# EAGLE schematic 4_cpu_alu (EAGLE 6.6.0)

## Sheet 1 of 2
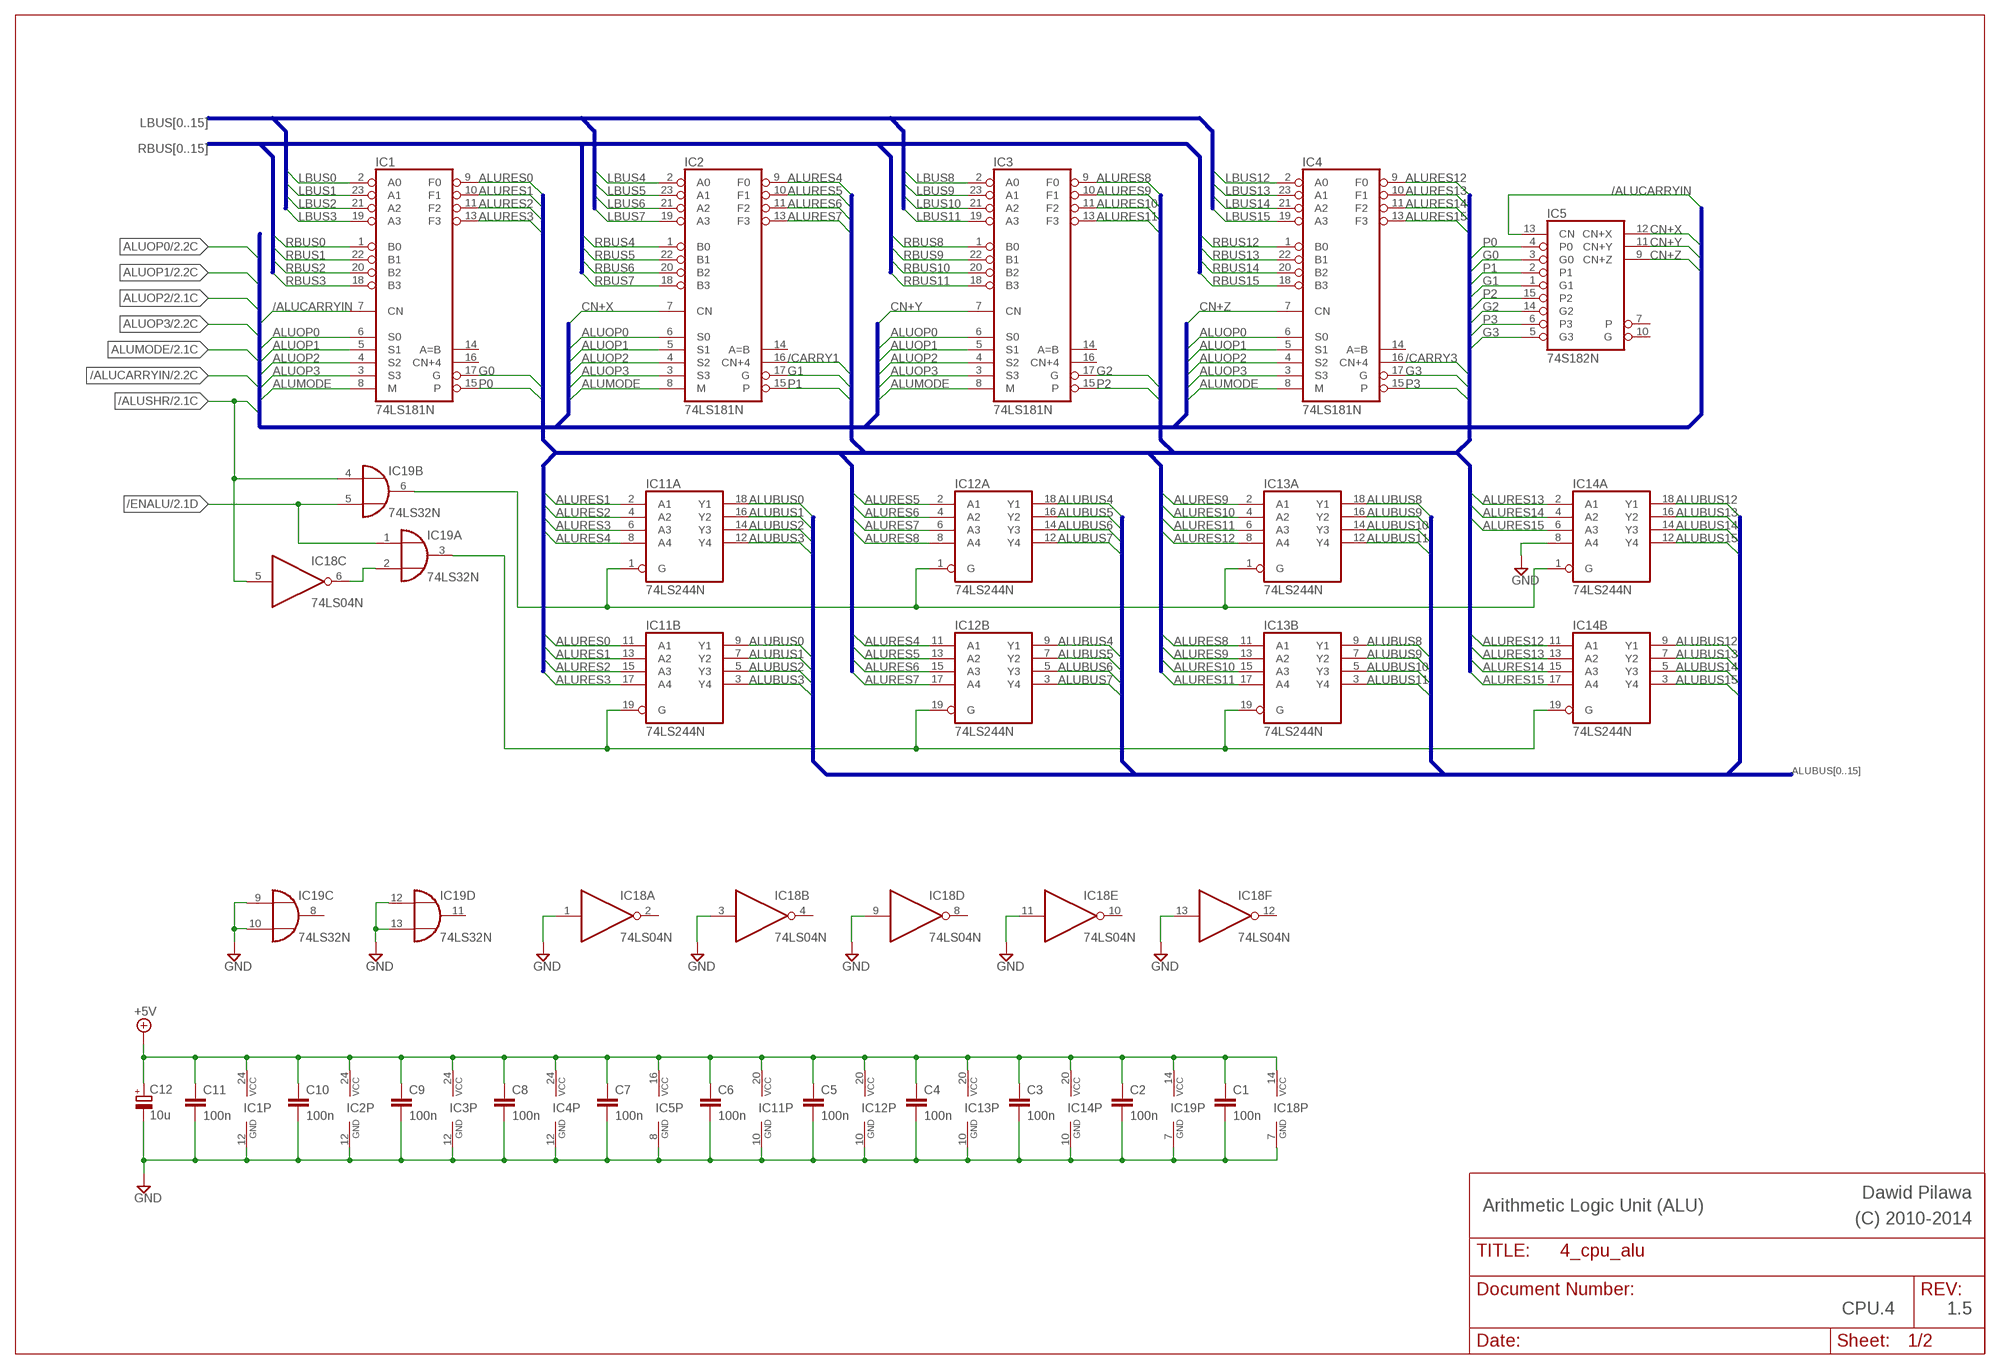
[diagram p0: schematic, sheet 1]

### Parts
C1  100n  C-EU050-024X044  [C050-024X044]
C2  100n  C-EU050-024X044  [C050-024X044]
C3  100n  C-EU050-024X044  [C050-024X044]
C4  100n  C-EU050-024X044  [C050-024X044]
C5  100n  C-EU050-024X044  [C050-024X044]
C6  100n  C-EU050-024X044  [C050-024X044]
C7  100n  C-EU050-024X044  [C050-024X044]
C8  100n  C-EU050-024X044  [C050-024X044]
C9  100n  C-EU050-024X044  [C050-024X044]
C10  100n  C-EU050-024X044  [C050-024X044]
C11  100n  C-EU050-024X044  [C050-024X044]
C12  10u  CPOL-EUE2.5-6  [E2,5-6]
IC1  74LS181N  [DIL24-6]
IC2  74LS181N  [DIL24-6]
IC3  74LS181N  [DIL24-6]
IC4  74LS181N  [DIL24-6]
IC5  74S182N  [DIL16]
IC11  74LS244N  [DIL20]
IC12  74LS244N  [DIL20]
IC13  74LS244N  [DIL20]
IC14  74LS244N  [DIL20]
IC18  74LS04N  [DIL14]
IC19  74LS32N  [DIL14]

### Nets
+5V: C1.1 C2.1 C3.1 C4.1 C5.1 C6.1 C7.1 C8.1 C9.1 C10.1 C11.1 C12.+ IC1.24(VCC) IC2.24(VCC) IC3.24(VCC) IC4.24(VCC) IC5.16(VCC) IC11.20(P:VCC) IC12.20(P:VCC) IC13.20(P:VCC) IC14.20(P:VCC) IC18.14(P:VCC) IC19.14(P:VCC) ; also sheet 2
/ALUCARRYIN: IC1.7(CN) IC5.13(CN) ; also sheet 2
/ALUSHR: IC18.5(C:I) IC19.4(B:I0) ; also sheet 2
/CARRY1: IC2.16(CN+4) ; also sheet 2
/CARRY3: IC4.16(CN+4) ; also sheet 2
/ENALU: IC19.1(A:I0) IC19.5(B:I1) ; also sheet 2
ALUBUS0: IC11.9(B:Y1) IC11.18(A:Y1) ; also sheet 2
ALUBUS1: IC11.7(B:Y2) IC11.16(A:Y2) ; also sheet 2
ALUBUS2: IC11.5(B:Y3) IC11.14(A:Y3) ; also sheet 2
ALUBUS3: IC11.3(B:Y4) IC11.12(A:Y4) ; also sheet 2
ALUBUS4: IC12.9(B:Y1) IC12.18(A:Y1) ; also sheet 2
ALUBUS5: IC12.7(B:Y2) IC12.16(A:Y2) ; also sheet 2
ALUBUS6: IC12.5(B:Y3) IC12.14(A:Y3) ; also sheet 2
ALUBUS7: IC12.3(B:Y4) IC12.12(A:Y4) ; also sheet 2
ALUBUS8: IC13.9(B:Y1) IC13.18(A:Y1) ; also sheet 2
ALUBUS9: IC13.7(B:Y2) IC13.16(A:Y2) ; also sheet 2
ALUBUS10: IC13.5(B:Y3) IC13.14(A:Y3) ; also sheet 2
ALUBUS11: IC13.3(B:Y4) IC13.12(A:Y4) ; also sheet 2
ALUBUS12: IC14.9(B:Y1) IC14.18(A:Y1) ; also sheet 2
ALUBUS13: IC14.7(B:Y2) IC14.16(A:Y2) ; also sheet 2
ALUBUS14: IC14.5(B:Y3) IC14.14(A:Y3) ; also sheet 2
ALUBUS15: IC14.3(B:Y4) IC14.12(A:Y4) ; also sheet 2
ALUMODE: IC1.8(M) IC2.8(M) IC3.8(M) IC4.8(M) ; also sheet 2
ALUOP0: IC1.6(S0) IC2.6(S0) IC3.6(S0) IC4.6(S0) ; also sheet 2
ALUOP1: IC1.5(S1) IC2.5(S1) IC3.5(S1) IC4.5(S1) ; also sheet 2
ALUOP2: IC1.4(S2) IC2.4(S2) IC3.4(S2) IC4.4(S2) ; also sheet 2
ALUOP3: IC1.3(S3) IC2.3(S3) IC3.3(S3) IC4.3(S3) ; also sheet 2
ALURES0: IC1.9(F0) IC11.11(B:A1) ; also sheet 2
ALURES1: IC1.10(F1) IC11.2(A:A1) IC11.13(B:A2)
ALURES2: IC1.11(F2) IC11.4(A:A2) IC11.15(B:A3)
ALURES3: IC1.13(F3) IC11.6(A:A3) IC11.17(B:A4)
ALURES4: IC2.9(F0) IC11.8(A:A4) IC12.11(B:A1)
ALURES5: IC2.10(F1) IC12.2(A:A1) IC12.13(B:A2)
ALURES6: IC2.11(F2) IC12.4(A:A2) IC12.15(B:A3)
ALURES7: IC2.13(F3) IC12.6(A:A3) IC12.17(B:A4)
ALURES8: IC3.9(F0) IC12.8(A:A4) IC13.11(B:A1) ; also sheet 2
ALURES9: IC3.10(F1) IC13.2(A:A1) IC13.13(B:A2)
ALURES10: IC3.11(F2) IC13.4(A:A2) IC13.15(B:A3)
ALURES11: IC3.13(F3) IC13.6(A:A3) IC13.17(B:A4)
ALURES12: IC4.9(F0) IC13.8(A:A4) IC14.11(B:A1)
ALURES13: IC4.10(F1) IC14.2(A:A1) IC14.13(B:A2)
ALURES14: IC4.11(F2) IC14.4(A:A2) IC14.15(B:A3)
ALURES15: IC4.13(F3) IC14.6(A:A3) IC14.17(B:A4)
CN+X: IC2.7(CN) IC5.12(CN+X)
CN+Y: IC3.7(CN) IC5.11(CN+Y)
CN+Z: IC4.7(CN) IC5.9(CN+Z)
G0: IC1.17(G) IC5.3(G0)
G1: IC2.17(G) IC5.1(G1)
G2: IC3.17(G) IC5.14(G2)
G3: IC4.17(G) IC5.5(G3)
GND: C1.2 C2.2 C3.2 C4.2 C5.2 C6.2 C7.2 C8.2 C9.2 C10.2 C11.2 C12.- IC1.12(GND) IC2.12(GND) IC3.12(GND) IC4.12(GND) IC5.8(GND) IC11.10(P:GND) IC12.10(P:GND) IC13.10(P:GND) IC14.8(A:A4) IC14.10(P:GND) IC18.1(A:I) IC18.3(B:I) IC18.7(P:GND) IC18.9(D:I) IC18.11(E:I) IC18.13(F:I) IC19.7(P:GND) IC19.9(C:I0) IC19.10(C:I1) IC19.12(D:I0) IC19.13(D:I1) ; also sheet 2
LBUS0: IC1.2(A0) ; also sheet 2
LBUS1: IC1.23(A1) ; also sheet 2
LBUS2: IC1.21(A2) ; also sheet 2
LBUS3: IC1.19(A3) ; also sheet 2
LBUS4: IC2.2(A0) ; also sheet 2
LBUS5: IC2.23(A1) ; also sheet 2
LBUS6: IC2.21(A2) ; also sheet 2
LBUS7: IC2.19(A3) ; also sheet 2
LBUS8: IC3.2(A0) ; also sheet 2
LBUS9: IC3.23(A1) ; also sheet 2
LBUS10: IC3.21(A2) ; also sheet 2
LBUS11: IC3.19(A3) ; also sheet 2
LBUS12: IC4.2(A0) ; also sheet 2
LBUS13: IC4.23(A1) ; also sheet 2
LBUS14: IC4.21(A2) ; also sheet 2
LBUS15: IC4.19(A3) ; also sheet 2
N$1: IC11.1(A:G) IC12.1(A:G) IC13.1(A:G) IC14.1(A:G) IC19.6(B:O)
N$4: IC18.6(C:O) IC19.2(A:I1)
N$5: IC11.19(B:G) IC12.19(B:G) IC13.19(B:G) IC14.19(B:G) IC19.3(A:O)
P0: IC1.15(P) IC5.4(P0)
P1: IC2.15(P) IC5.2(P1)
P2: IC3.15(P) IC5.15(P2)
P3: IC4.15(P) IC5.6(P3)
RBUS0: IC1.1(B0) ; also sheet 2
RBUS1: IC1.22(B1) ; also sheet 2
RBUS2: IC1.20(B2) ; also sheet 2
RBUS3: IC1.18(B3) ; also sheet 2
RBUS4: IC2.1(B0) ; also sheet 2
RBUS5: IC2.22(B1) ; also sheet 2
RBUS6: IC2.20(B2) ; also sheet 2
RBUS7: IC2.18(B3) ; also sheet 2
RBUS8: IC3.1(B0) ; also sheet 2
RBUS9: IC3.22(B1) ; also sheet 2
RBUS10: IC3.20(B2) ; also sheet 2
RBUS11: IC3.18(B3) ; also sheet 2
RBUS12: IC4.1(B0) ; also sheet 2
RBUS13: IC4.22(B1) ; also sheet 2
RBUS14: IC4.20(B2) ; also sheet 2
RBUS15: IC4.18(B3) ; also sheet 2
Unconnected: IC1.14(A=B) IC1.16(CN+4) IC2.14(A=B) IC3.14(A=B) IC3.16(CN+4) IC4.14(A=B) IC5.7(P) IC5.10(G) IC18.2(A:O) IC18.4(B:O) IC18.8(D:O) IC18.10(E:O) IC18.12(F:O) IC19.8(C:O) IC19.11(D:O)

### Buses
RBUS[0..15]
LBUS[0..15]
ALUOP[0..3],ALUMODE,/ALUSHR,/ALUCARRYIN,CN+X,CN+Y,CN+Z
ALURES[0..15],/CARRY[0..3],P[0..3],G[0..3]
ALUBUS[0..15]

### Notes on the sheet
- Dawid Pilawa
- Arithmetic Logic Unit (ALU) | (C) 2010-2014
- CPU.4 | 1.5

## Sheet 2 of 2
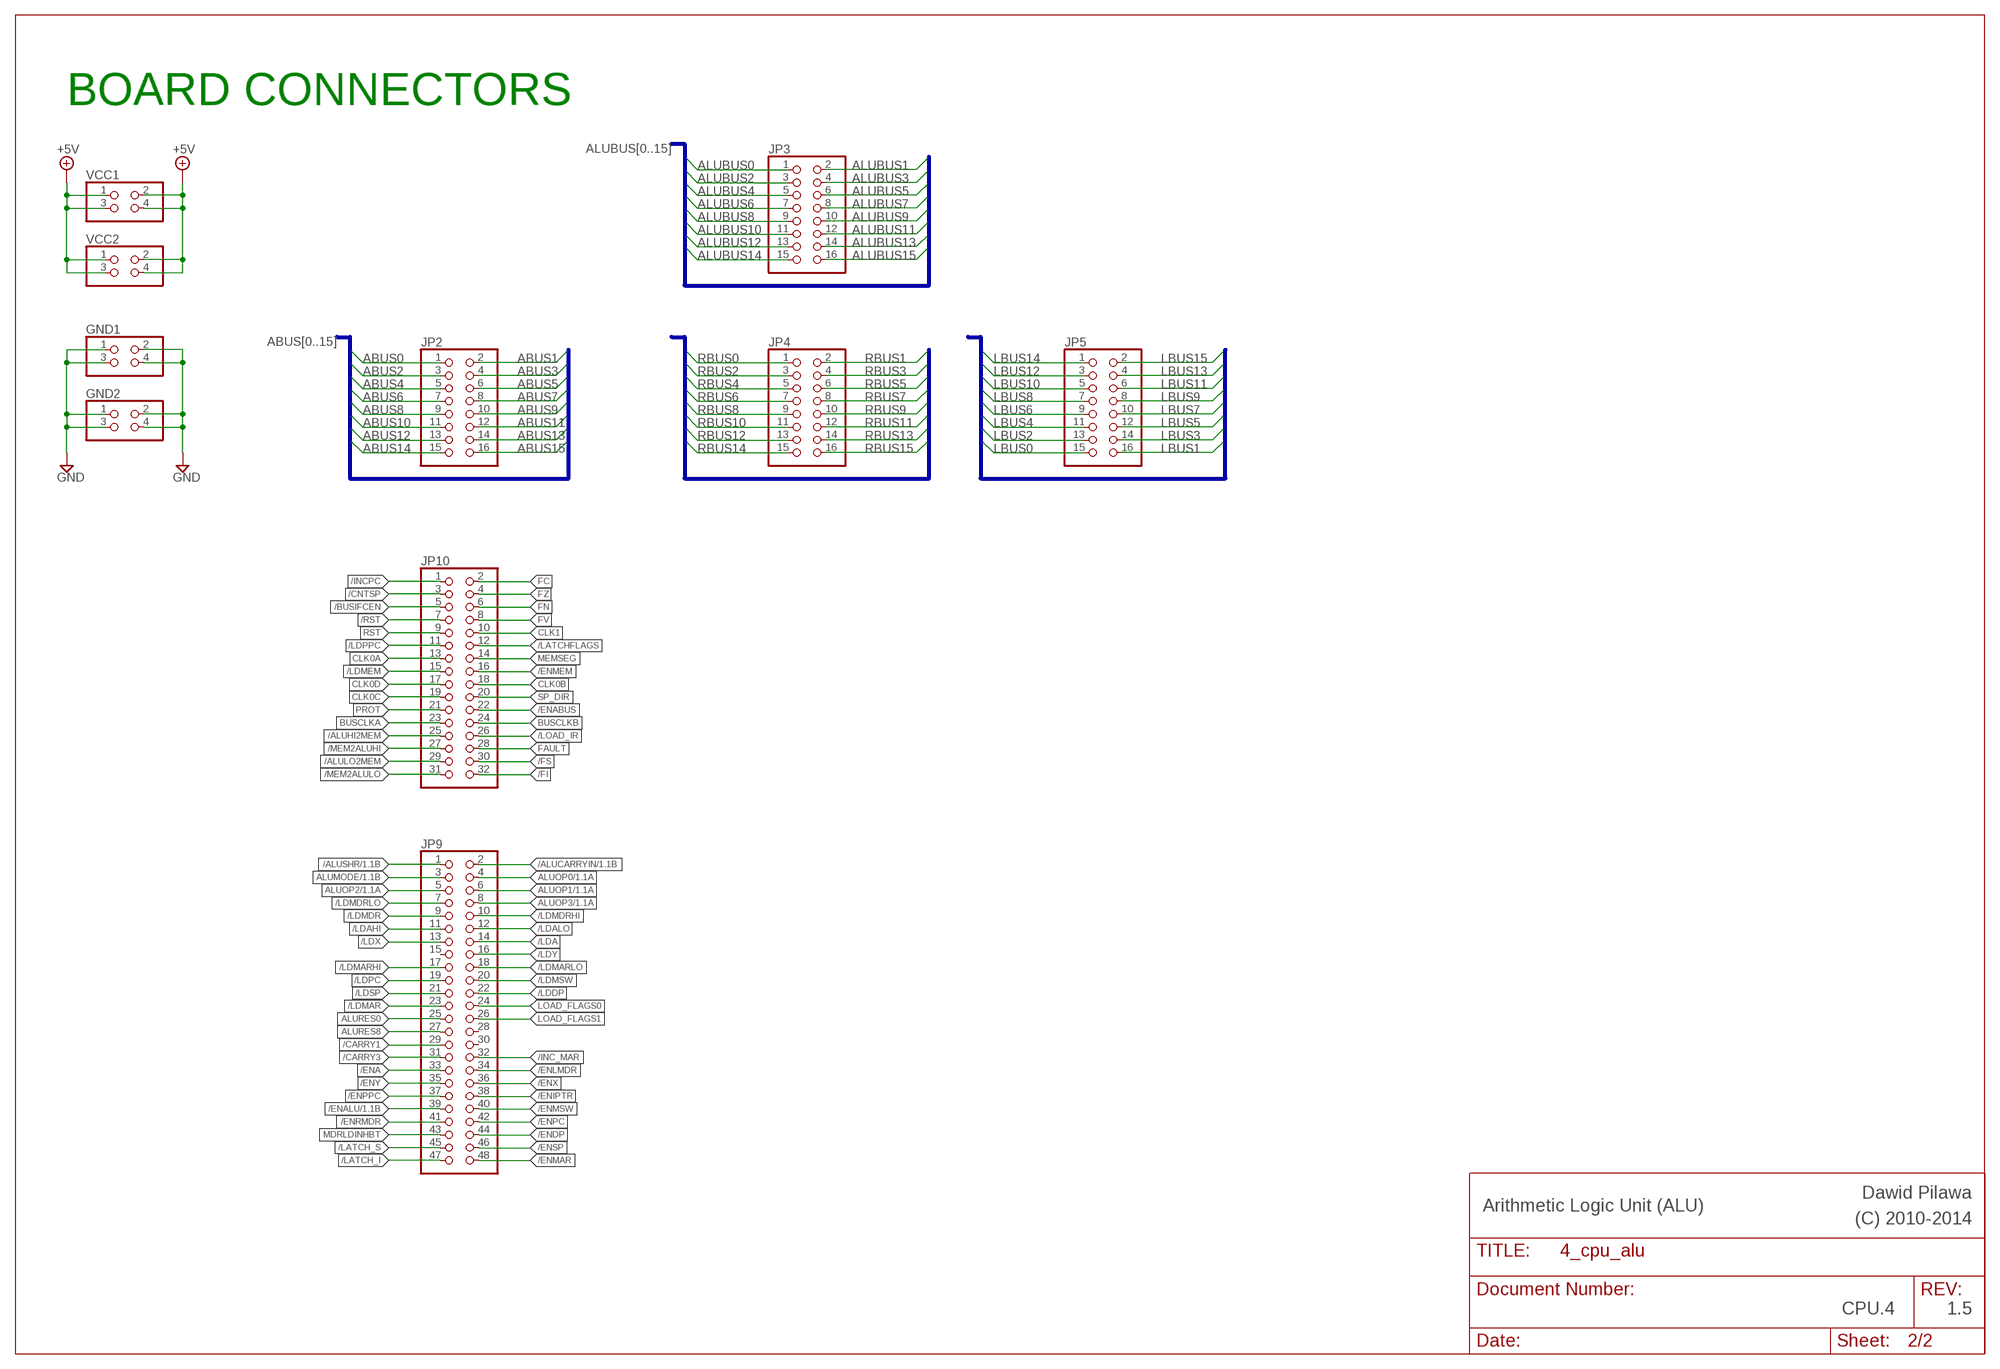
[diagram p1: schematic, sheet 2]

### Parts
GND1  PINHD-2X2  [2X02]
GND2  PINHD-2X2  [2X02]
JP2  PINHD-2X8  [2X08]
JP3  PINHD-2X8  [2X08]
JP4  PINHD-2X8  [2X08]
JP5  PINHD-2X8  [2X08]
JP9  PINHD-2X24  [2X24]
JP10  PINHD-2X16  [2X16]
VCC1  PINHD-2X2  [2X02]
VCC2  PINHD-2X2  [2X02]

### Nets
+5V: VCC1.1 VCC1.2 VCC1.3 VCC1.4 VCC2.1 VCC2.2 VCC2.3 VCC2.4 ; also sheet 1
/ALUCARRYIN: JP9.2 ; also sheet 1
/ALUHI2MEM: JP10.25
/ALULO2MEM: JP10.29
/ALUSHR: JP9.1 ; also sheet 1
/BUSIFCEN: JP10.5
/CARRY1: JP9.29 ; also sheet 1
/CARRY3: JP9.31 ; also sheet 1
/CNTSP: JP10.3
/ENA: JP9.33
/ENABUS: JP10.22
/ENALU: JP9.39 ; also sheet 1
/ENDP: JP9.44
/ENIPTR: JP9.38
/ENLMDR: JP9.34
/ENMAR: JP9.48
/ENMEM: JP10.16
/ENMSW: JP9.40
/ENPC: JP9.42
/ENPPC: JP9.37
/ENRMDR: JP9.41
/ENSP: JP9.46
/ENX: JP9.36
/ENY: JP9.35
/FI: JP10.32
/FS: JP10.30
/INC_MAR: JP9.32
/INCPC: JP10.1
/LATCH_I: JP9.47
/LATCH_S: JP9.45
/LATCHFLAGS: JP10.12
/LDA: JP9.14
/LDAHI: JP9.11
/LDALO: JP9.12
/LDDP: JP9.22
/LDMAR: JP9.23
/LDMARHI: JP9.17
/LDMARLO: JP9.18
/LDMDR: JP9.9
/LDMDRHI: JP9.10
/LDMDRLO: JP9.7
/LDMEM: JP10.15
/LDMSW: JP9.20
/LDPC: JP9.19
/LDPPC: JP10.11
/LDSP: JP9.21
/LDX: JP9.13
/LDY: JP9.16
/LOAD_IR: JP10.26
/MEM2ALUHI: JP10.27
/MEM2ALULO: JP10.31
/RST: JP10.7
ABUS0: JP2.1
ABUS1: JP2.2
ABUS2: JP2.3
ABUS3: JP2.4
ABUS4: JP2.5
ABUS5: JP2.6
ABUS6: JP2.7
ABUS7: JP2.8
ABUS8: JP2.9
ABUS9: JP2.10
ABUS10: JP2.11
ABUS11: JP2.12
ABUS12: JP2.13
ABUS13: JP2.14
ABUS14: JP2.15
ABUS15: JP2.16
ALUBUS0: JP3.1 ; also sheet 1
ALUBUS1: JP3.2 ; also sheet 1
ALUBUS2: JP3.3 ; also sheet 1
ALUBUS3: JP3.4 ; also sheet 1
ALUBUS4: JP3.5 ; also sheet 1
ALUBUS5: JP3.6 ; also sheet 1
ALUBUS6: JP3.7 ; also sheet 1
ALUBUS7: JP3.8 ; also sheet 1
ALUBUS8: JP3.9 ; also sheet 1
ALUBUS9: JP3.10 ; also sheet 1
ALUBUS10: JP3.11 ; also sheet 1
ALUBUS11: JP3.12 ; also sheet 1
ALUBUS12: JP3.13 ; also sheet 1
ALUBUS13: JP3.14 ; also sheet 1
ALUBUS14: JP3.15 ; also sheet 1
ALUBUS15: JP3.16 ; also sheet 1
ALUMODE: JP9.3 ; also sheet 1
ALUOP0: JP9.4 ; also sheet 1
ALUOP1: JP9.6 ; also sheet 1
ALUOP2: JP9.5 ; also sheet 1
ALUOP3: JP9.8 ; also sheet 1
ALURES0: JP9.25 ; also sheet 1
ALURES8: JP9.27 ; also sheet 1
BUSCLKA: JP10.23
BUSCLKB: JP10.24
CLK0A: JP10.13
CLK0B: JP10.18
CLK0C: JP10.19
CLK0D: JP10.17
CLK1: JP10.10
FAULT: JP10.28
FC: JP10.2
FN: JP10.6
FV: JP10.8
FZ: JP10.4
GND: GND1.1 GND1.2 GND1.3 GND1.4 GND2.1 GND2.2 GND2.3 GND2.4 ; also sheet 1
LBUS0: JP5.15 ; also sheet 1
LBUS1: JP5.16 ; also sheet 1
LBUS2: JP5.13 ; also sheet 1
LBUS3: JP5.14 ; also sheet 1
LBUS4: JP5.11 ; also sheet 1
LBUS5: JP5.12 ; also sheet 1
LBUS6: JP5.9 ; also sheet 1
LBUS7: JP5.10 ; also sheet 1
LBUS8: JP5.7 ; also sheet 1
LBUS9: JP5.8 ; also sheet 1
LBUS10: JP5.5 ; also sheet 1
LBUS11: JP5.6 ; also sheet 1
LBUS12: JP5.3 ; also sheet 1
LBUS13: JP5.4 ; also sheet 1
LBUS14: JP5.1 ; also sheet 1
LBUS15: JP5.2 ; also sheet 1
LOAD_FLAGS0: JP9.24
LOAD_FLAGS1: JP9.26
MDRLDINHBT: JP9.43
MEMSEG: JP10.14
PROT: JP10.21
RBUS0: JP4.1 ; also sheet 1
RBUS1: JP4.2 ; also sheet 1
RBUS2: JP4.3 ; also sheet 1
RBUS3: JP4.4 ; also sheet 1
RBUS4: JP4.5 ; also sheet 1
RBUS5: JP4.6 ; also sheet 1
RBUS6: JP4.7 ; also sheet 1
RBUS7: JP4.8 ; also sheet 1
RBUS8: JP4.9 ; also sheet 1
RBUS9: JP4.10 ; also sheet 1
RBUS10: JP4.11 ; also sheet 1
RBUS11: JP4.12 ; also sheet 1
RBUS12: JP4.13 ; also sheet 1
RBUS13: JP4.14 ; also sheet 1
RBUS14: JP4.15 ; also sheet 1
RBUS15: JP4.16 ; also sheet 1
RST: JP10.9
SP_DIR: JP10.20
Unconnected: JP9.15 JP9.28 JP9.30

### Buses
RBUS[0..15]
LBUS[0..15]
ALUBUS[0..15]
ABUS[0..15]

### Notes on the sheet
- BOARD CONNECTORS
- Dawid Pilawa
- Arithmetic Logic Unit (ALU) | (C) 2010-2014
- CPU.4 | 1.5

## Library data of the parts
C1-C11 = rcl:C-EU: CAPACITOR, European symbol
C12 = rcl:CPOL-EU: POLARIZED CAPACITOR, European symbol
GND1 GND2 VCC1 VCC2 = pinhead:PINHD-2X2: PIN HEADER
IC1-IC4 = 74xx-eu:74*181: ARITHMETIC LOGIC UNIT function generator
IC5 = 74xx-eu:74*182: LOOK AHEAD CARRY GENERATOR
IC11-IC14 = 74xx-eu:74*244: Octal BUFFER and LINE DRIVER, 3-state
IC18 = 74xx-eu:74*04: Hex INVERTER
IC19 = 74xx-eu:74*32: Quad 2-input OR gate
JP2-JP5 = pinhead:PINHD-2X8: PIN HEADER
JP9 = pinhead:PINHD-2X24: PIN HEADER
JP10 = pinhead:PINHD-2X16: PIN HEADER